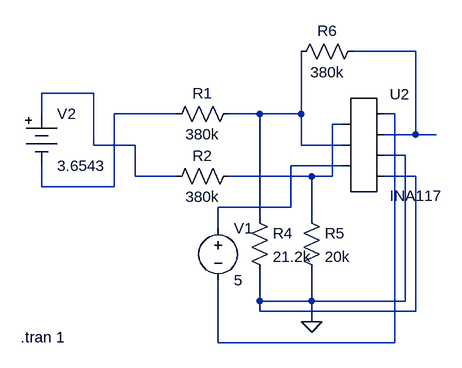
[diagram p0: schematic ina117simulation.asc]
ina117simulation.asc, the LTspice schematic file:
Version 4
SHEET 1 880 816
WIRE 368 -16 272 -16
WIRE -128 48 -208 48
WIRE -208 80 -208 48
WIRE 0 80 -96 80
WIRE 128 80 80 80
WIRE 192 80 192 -16
WIRE 192 80 128 80
WIRE 336 80 320 80
WIRE 256 96 240 96
WIRE 368 112 368 -16
WIRE 368 112 320 112
WIRE 400 112 368 112
WIRE -128 128 -128 48
WIRE -64 128 -128 128
WIRE 192 128 192 80
WIRE 256 128 192 128
WIRE 352 144 320 144
WIRE 256 160 176 160
WIRE -64 176 -64 128
WIRE 0 176 -64 176
WIRE 208 176 80 176
WIRE 240 176 240 96
WIRE 240 176 208 176
WIRE 368 176 320 176
WIRE -208 192 -208 160
WIRE -96 192 -96 80
WIRE -96 192 -208 192
WIRE 176 224 176 160
WIRE 176 224 64 224
WIRE 128 240 128 80
WIRE 208 240 208 176
WIRE 64 256 64 224
WIRE 128 368 128 320
WIRE 208 368 208 320
WIRE 208 368 128 368
WIRE 352 368 352 144
WIRE 352 368 208 368
WIRE 128 384 128 368
WIRE 368 384 368 176
WIRE 368 384 128 384
WIRE 208 400 208 368
WIRE 64 432 64 336
WIRE 336 432 336 80
WIRE 336 432 64 432
FLAG 208 400 0
DATAFLAG -48 80 ""
DATAFLAG 384 112 ""
DATAFLAG -48 176 ""
SYMBOL res 96 64 R90
WINDOW 0 0 56 VBottom 2
WINDOW 3 32 56 VTop 2
SYMATTR InstName R1
SYMATTR Value 380k
SYMBOL res 96 160 R90
WINDOW 0 0 56 VBottom 2
WINDOW 3 32 56 VTop 2
SYMATTR InstName R2
SYMATTR Value 380k
SYMBOL voltage 64 240 R0
WINDOW 123 0 0 Left 0
WINDOW 39 0 0 Left 0
SYMATTR InstName V1
SYMATTR Value 5
SYMBOL Misc\\battery -208 64 R0
WINDOW 123 0 0 Left 0
WINDOW 39 0 0 Left 0
SYMATTR InstName V2
SYMATTR Value 3.6543
SYMBOL res 112 224 R0
SYMATTR InstName R4
SYMATTR Value 21.2k
SYMBOL res 192 224 R0
SYMATTR InstName R5
SYMATTR Value 20k
SYMBOL res 288 -32 R90
WINDOW 0 0 56 VBottom 2
WINDOW 3 32 56 VTop 2
SYMATTR InstName R6
SYMATTR Value 380k
SYMBOL AutoGenerated\\INA117 288 128 R0
SYMATTR InstName U2
TEXT -240 424 Left 2 !.tran 1

The netlist it stands for:
* ina117simulation.asc
R1 N004 N003 380k
R2 N006 N002 380k
V1 N007 N005 5
V2 N002 N003 3.6543
R4 N004 0 21.2k
R5 N006 0 20k
R6 N001 N004 380k
* U2: INA117 (symbol AutoGenerated\INA117 not available, pins judged from their places): pin1=N006 pin2=N004 pin3=N007 pin4=N005 pin5=N001 pin6=0 pin7=0
.tran 1
.backanno
.end